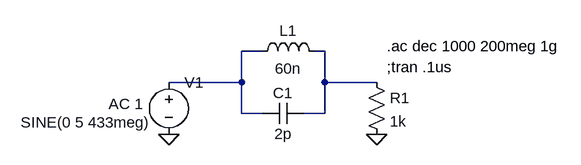
[diagram p0: schematic tank.asc]
tank.asc, the LTspice schematic file:
Version 4
SHEET 1 880 680
WIRE 0 144 -32 144
WIRE 96 144 80 144
WIRE -32 192 -32 144
WIRE -32 192 -144 192
WIRE 96 192 96 144
WIRE 176 192 96 192
WIRE -32 240 -32 192
WIRE 0 240 -32 240
WIRE 96 240 96 192
WIRE 96 240 64 240
FLAG -144 272 0
FLAG 176 272 0
SYMBOL cap 64 224 R90
WINDOW 0 0 32 VBottom 2
WINDOW 3 32 32 VTop 2
SYMATTR InstName C1
SYMATTR Value 2p
SYMBOL ind -16 160 R270
WINDOW 0 32 56 VTop 2
WINDOW 3 5 56 VBottom 2
SYMATTR InstName L1
SYMATTR Value 60n
SYMBOL voltage -144 176 R0
WINDOW 123 -93 49 Left 2
WINDOW 39 0 0 Left 2
WINDOW 3 -228 78 Left 2
SYMATTR Value2 AC 1
SYMATTR Value SINE(0 5 433meg)
SYMATTR InstName V1
SYMBOL res 160 176 R0
SYMATTR InstName R1
SYMATTR Value 1k
TEXT 192 168 Left 2 !;tran .1us
TEXT 192 136 Left 2 !.ac dec 1000 200meg 1g

The netlist it stands for:
* tank.asc
C1 N002 N001 2p
L1 N001 N002 60n
V1 N001 0 SINE(0 5 433meg) AC 1
R1 N002 0 1k
;tran .1us
.ac dec 1000 200meg 1g
.backanno
.end